# EasyEDA schematic Potentiometer.json
TITLE: Potentiometer; REV: 1.0; Date: No; Sheet: 1/1; Drawn By: Sanmitra Goswami AM25B134
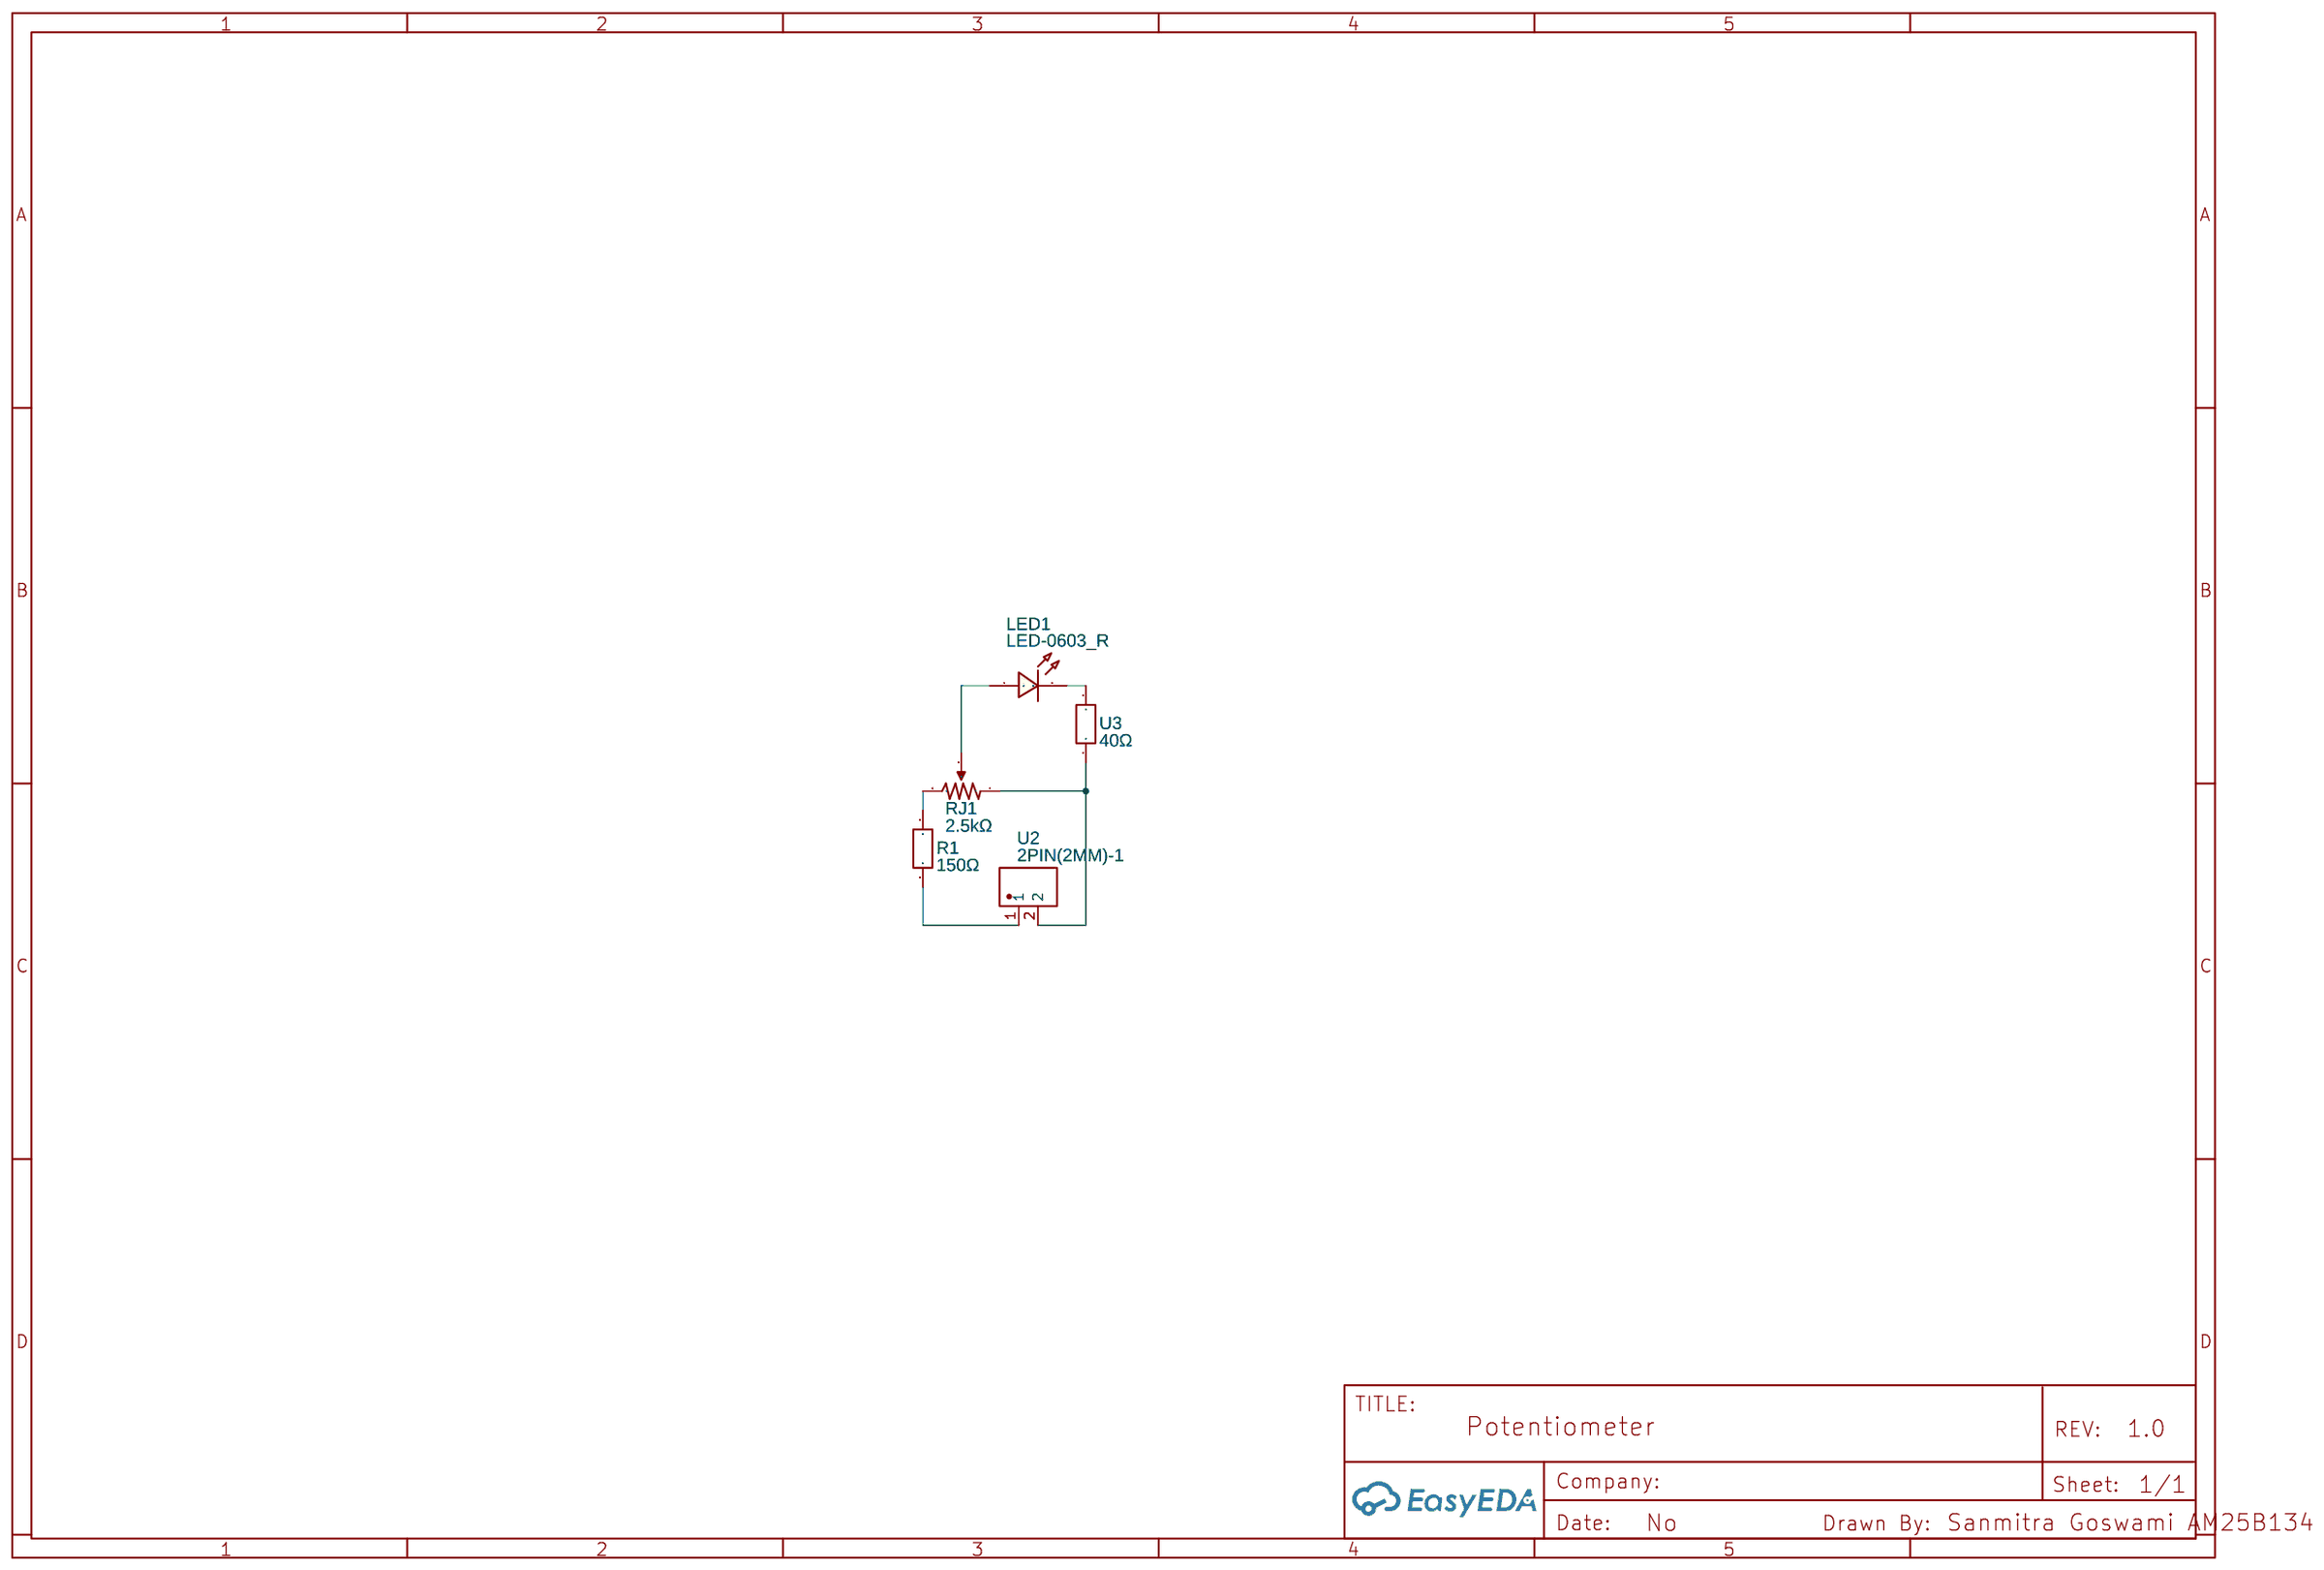
[diagram p0: schematic sheet]

## Parts
LED1  LED-0603_R  [LED0603_RED]
R1  150Ω  [RES-TH_BD2.3-L3.7-P7.70-D0.9]
RJ1  2.5kΩ  [RES-ADJ-TH_3386P]
U2  2PIN(2MM)-1  [CONN-TH_2PIN2MM-1]
U3  40Ω  [RES-TH_L15.9-W8.7-P12.70-D0.8]

## Library data of the parts
LED1 = LED-0603_R: Manufacturer: EVERLIGHT(台湾亿光); Manufacturer Part: 19-217/R6C-AL1M2VY/3T; Supplier Part: C72044; Supplier: LCSC; Contributor: LCEDA_01
R1 = CR1/8W-150Ω±5%-ST26: Contributor: lcsc; Supplier: LCSC; Supplier Part: C2896939; Manufacturer: VO(翔胜); JLCPCB Part Class: Extended Part
RJ1 = 3386P-1-252LF: Supplier: LCSC; Supplier Part: C5512020; Manufacturer: BOURNS; Contributor: lcsc; JLCPCB Part Class: Extended Part
U2 = 2PIN(2MM)-1: Contributor: LCSC; Supplier: LCSC; Supplier Part: C9900004826; Manufacturer: null; JLCPCB Part Class: Extended Part
U3 = R5J40RE: Contributor: lcsc; Supplier: LCSC; Supplier Part: C3471745; Manufacturer: Ohmite; JLCPCB Part Class: Extended Part

## Nets
Net-(LED1-1): LED1.1 RJ1.2
Net-(LED1-2): LED1.2 U3.2
Net-(R1-1): R1.1 U2.1
Net-(R1-2): R1.2 RJ1.3
Net-(RJ1-1): RJ1.1 U2.2 U3.1
